# Altium schematic sheet SensorBoard_v1.SchDoc
size A
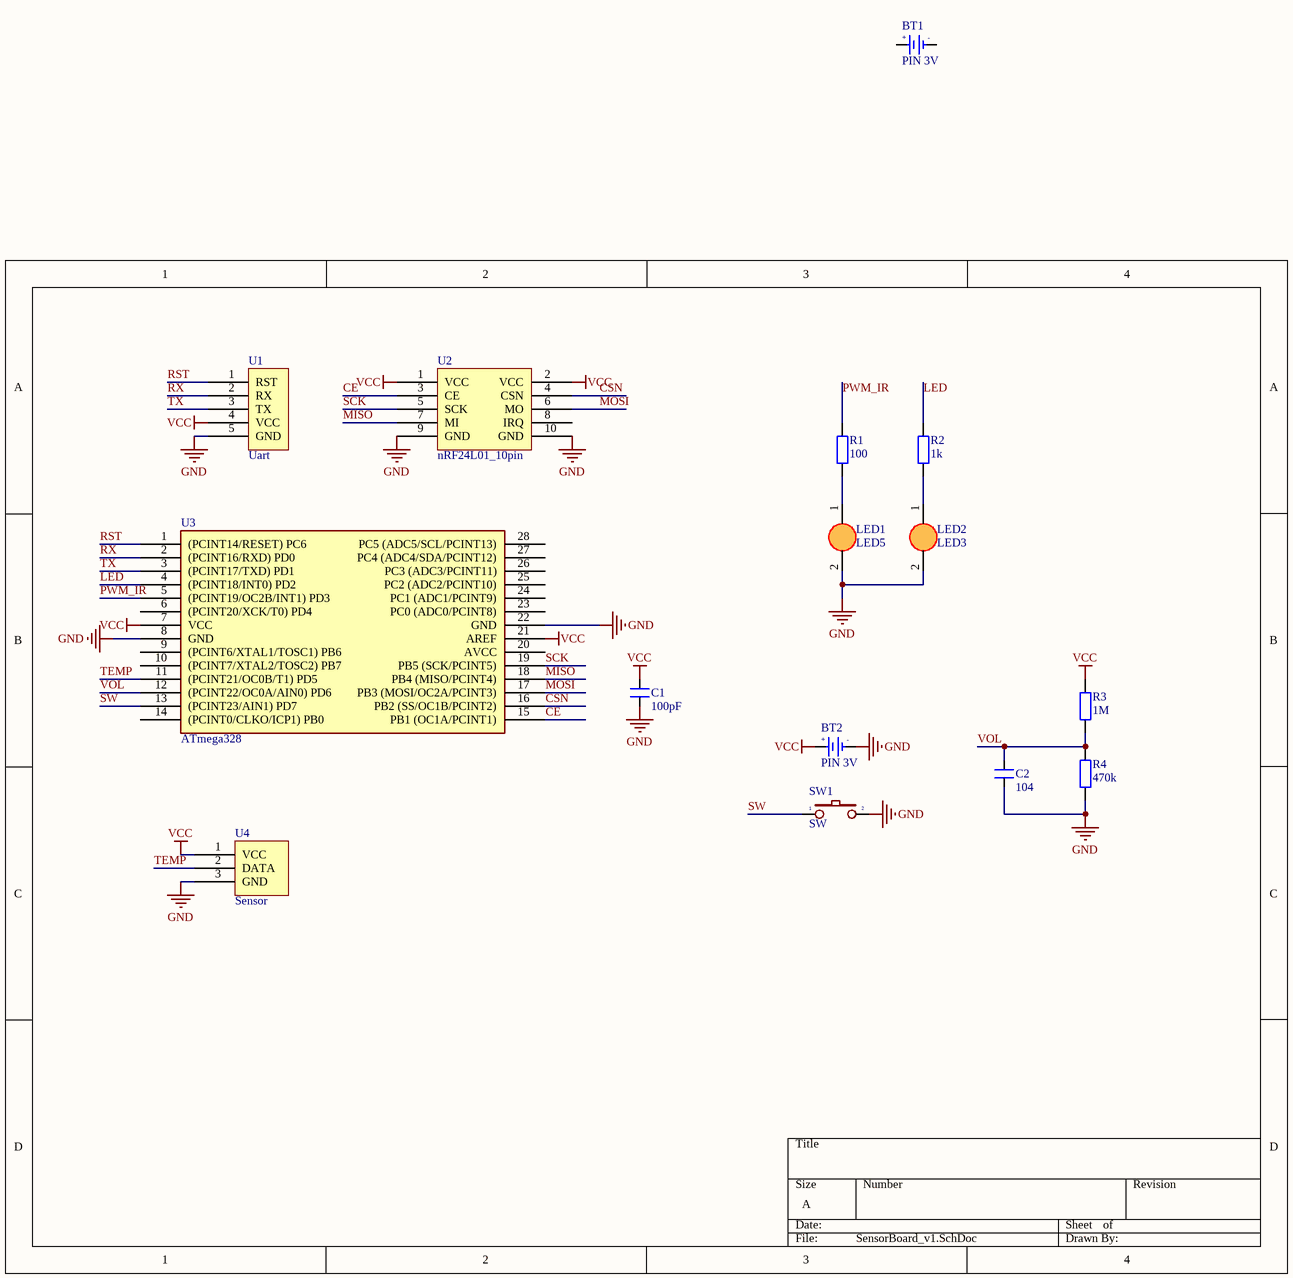
[diagram p0: SensorBoard_v1.SchDoc]

## Parts
BT1  PIN 3V  [PIN3V]
BT2  PIN 3V  [PIN3V]
C1  100pF  [CN1]
C2  104  [CN1.5]
LED1  LED5  [LED5MM]
LED2  LED3  [LED3mm]
R1  100  [R1/4W]
R2  1k  [R1/4W]
R3  1M  [R1/4W]
R4  470k  [R1/4W]
SW1  SW  [SW2]
U1  Uart  [CONG NAP]
U2  nRF24L01_10pin  [NRF24L01_10PIN]
U3  ATmega328  [DIP28]
U4  Sensor  [TEMPSENSOR]

## Nets
GND: BT2.2(GND) C1.2 C2.2 LED1.2(K) LED2.2(K) R4.2 SW1.2 U1.5(GND) U2.9(GND) U2.10(GND) U3.8(GND) U3.22(GND) U4.3(GND)
VCC: BT2.1(+3V) C1.1 R3.1 U1.4(VCC) U2.1(VCC) U2.2(VCC) U3.7(VCC) U3.21(AREF) U4.1(VCC)
CE: U2.3(CE) U3.15(PB1_(OC1A/PCINT1))
CSN: U2.4(CSN) U3.16(PB2_(SS/OC1B/PCINT2))
LED: R2.1 U3.4((PCINT18/INT0)_PD2)
MISO: U2.7(MI) U3.18(PB4_(MISO/PCINT4))
MOSI: U2.6(MO) U3.17(PB3_(MOSI/OC2A/PCINT3))
PWM_IR: R1.2 U3.5((PCINT19/OC2B/INT1)_PD3)
RST: U1.1(RST) U3.1((PCINT14/RESET)_PC6)
RX: U1.2(RX) U3.2((PCINT16/RXD)_PD0)
SCK: U2.5(SCK) U3.19(PB5_(SCK/PCINT5))
SW: SW1.1 U3.13((PCINT23/AIN1)_PD7)
TEMP: U3.11((PCINT21/OC0B/T1)_PD5) U4.2(DATA)
TX: U1.3(TX) U3.3((PCINT17/TXD)_PD1)
VOL: C2.1 R3.2 R4.1 U3.12((PCINT22/OC0A/AIN0)_PD6)
NetLED1_1: LED1.1(A) R1.1
NetLED2_1: LED2.1(A) R2.2

Not connected (* = marked no-connect by the designer): BT1 1(+3V) 2(GND); U2 8(IRQ); U3 6((PCINT20/XCK/T0)_PD4) 9((PCINT6/XTAL1/TOSC1)_PB6) 10((PCINT7/XTAL2/TOSC2)_PB7) 14((PCINT0/CLKO/ICP1)_PB0) 20(AVCC) 23(PC0_(ADC0/PCINT8)) 24(PC1_(ADC1/PCINT9)) 25(PC2_(ADC2/PCINT10)) 26(PC3_(ADC3/PCINT11)) 27(PC4_(ADC4/SDA/PCINT12)) 28(PC5_(ADC5/SCL/PCINT13))

## Notes on the sheet
- (in symbol PIN 3V) +; -

## Library data of the parts
BT1 BT2 = PIN 3V: Battery 3VDC; Value: PIN 3V
C1 = CN1: Cap np  1pF - 472pF; Value: 100pF
C2 = CN1.5: Cap np 682pF => 104pF; Value: 0.01uF
LED1 = LED 5mm
LED2 = LED 3mm
R1-R4 = R1/4W: Resistor 1/4W; Value: R1/4W - 1K
SW1 = SW2: Switch button 2 pin; Value: SW chip 2 pin
U1 = CONG NAP
U4 = Temp Sensor